# Altium schematic sheet Nestling_2.1_EXB_OLED.SchDoc
size A4
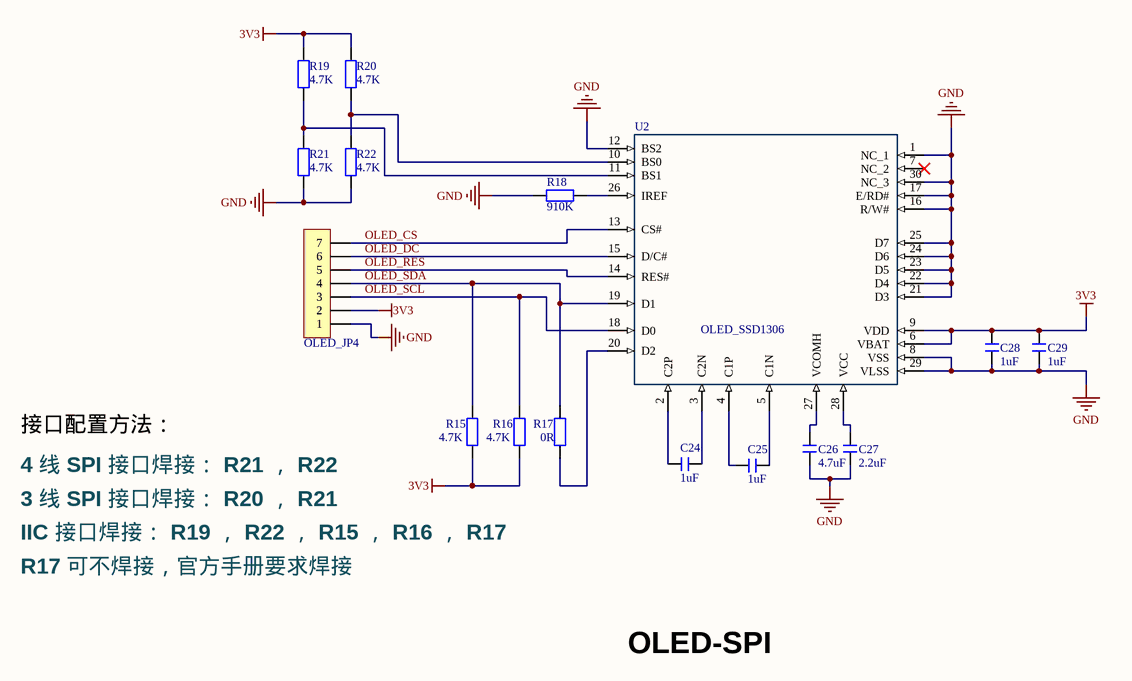
[diagram p0: Nestling_2.1_EXB_OLED.SchDoc]

## Parts
C24  1uF  [C 0603_M]
C25  1uF  [C 0603_M]
C26  4.7uF  [C 0603_M]
C27  2.2uF  [C 0603_M]
C28  1uF  [C 0603_M]
C29  1uF  [C 0603_M]
OLED_JP4  HDR-1X7  [HDR2.54-M-LI-7P]  (value not drawn)
R15  4.7K  [R 0603_M]
R16  4.7K  [R 0603_M]
R17  0R  [R 0603_M]
R18  910K  [R 0603_M]
R19  4.7K  [R 0603_M]
R20  4.7K  [R 0603_M]
R21  4.7K  [R 0603_M]
R22  4.7K  [R 0603_M]
U2  OLED_SSD1306  [30P_0.7mm]

## Nets
3V3: C28.1 C29.1 OLED_JP4.2 R15.2 R16.2 R19.2 R20.2 U2.6(VBAT) U2.9(VDD)
GND: C26.2 C27.2 C28.2 C29.2 OLED_JP4.1 R18.1 R21.1 R22.1 U2.1(NC_1) U2.8(VSS) U2.12(BS2) U2.16(R/W#) U2.17(E/RD#) U2.21(D3) U2.22(D4) U2.23(D5) U2.24(D6) U2.25(D7) U2.29(VLSS) U2.30(NC_3)
OLED_CS: OLED_JP4.7 U2.13(CS#)
OLED_DC: OLED_JP4.6 U2.15(D/C#)
OLED_RES: OLED_JP4.5 U2.14(RES#)
OLED_SCL: OLED_JP4.3 R16.1 U2.18(D0)
OLED_SDA: OLED_JP4.4 R15.1 R17.1 U2.19(D1)
NetC24_1: C24.1 U2.2(C2P)
NetC24_2: C24.2 U2.3(C2N)
NetC25_1: C25.1 U2.4(C1P)
NetC25_2: C25.2 U2.5(C1N)
NetC26_1: C26.1 U2.27(VCOMH)
NetC27_1: C27.1 U2.28(VCC)
NetR17_2: R17.2 U2.20(D2)
NetR18_2: R18.2 U2.26(IREF)
NetR19_1: R19.1 R21.2 U2.11(BS1)
NetR20_1: R20.1 R22.2 U2.10(BS0)

Not connected (* = marked no-connect by the designer): U2 7(NC_2)*

## Notes on the sheet
- 接口配置方法：
- 4 线 SPI 接口焊接： R21 ， R22
- 3 线 SPI 接口焊接： R20 ， R21
- IIC 接口焊接： R19 ， R22 ， R15 ， R16 ， R17
- R17 可不焊接，官方手册要求焊接
- OLED-SPI

## Library data of the parts
C24-C29 = C: 无极性贴片电容; 版权归属: 源创客; BOM名称: 无极性贴片电容; 学习资源: www.ooocke.com
OLED_JP4 = Header 7: 7P接插件; 版权归属: 源创客; BOM名称: 7P接插件; 学习资源: www.ooocke.com
R15-R22 = RES: Resistor
U2 = OLED_0.96_SSD1306: OLED_0.96寸_SSD1306，裸屏接口